# Altium schematic sheet logic.SchDoc: ADC & Delay
size A4; Author: Niklas Fauth; DrawnBy: Niklas Fauth; Address4: Niklas Fauth; Revision: V1.0; SheetNumber: 2; SheetTotal: 5; ProjectName: Jammer; Rule: PcbType=ProtelPcb; Rule: PcbType=ProtelPcb
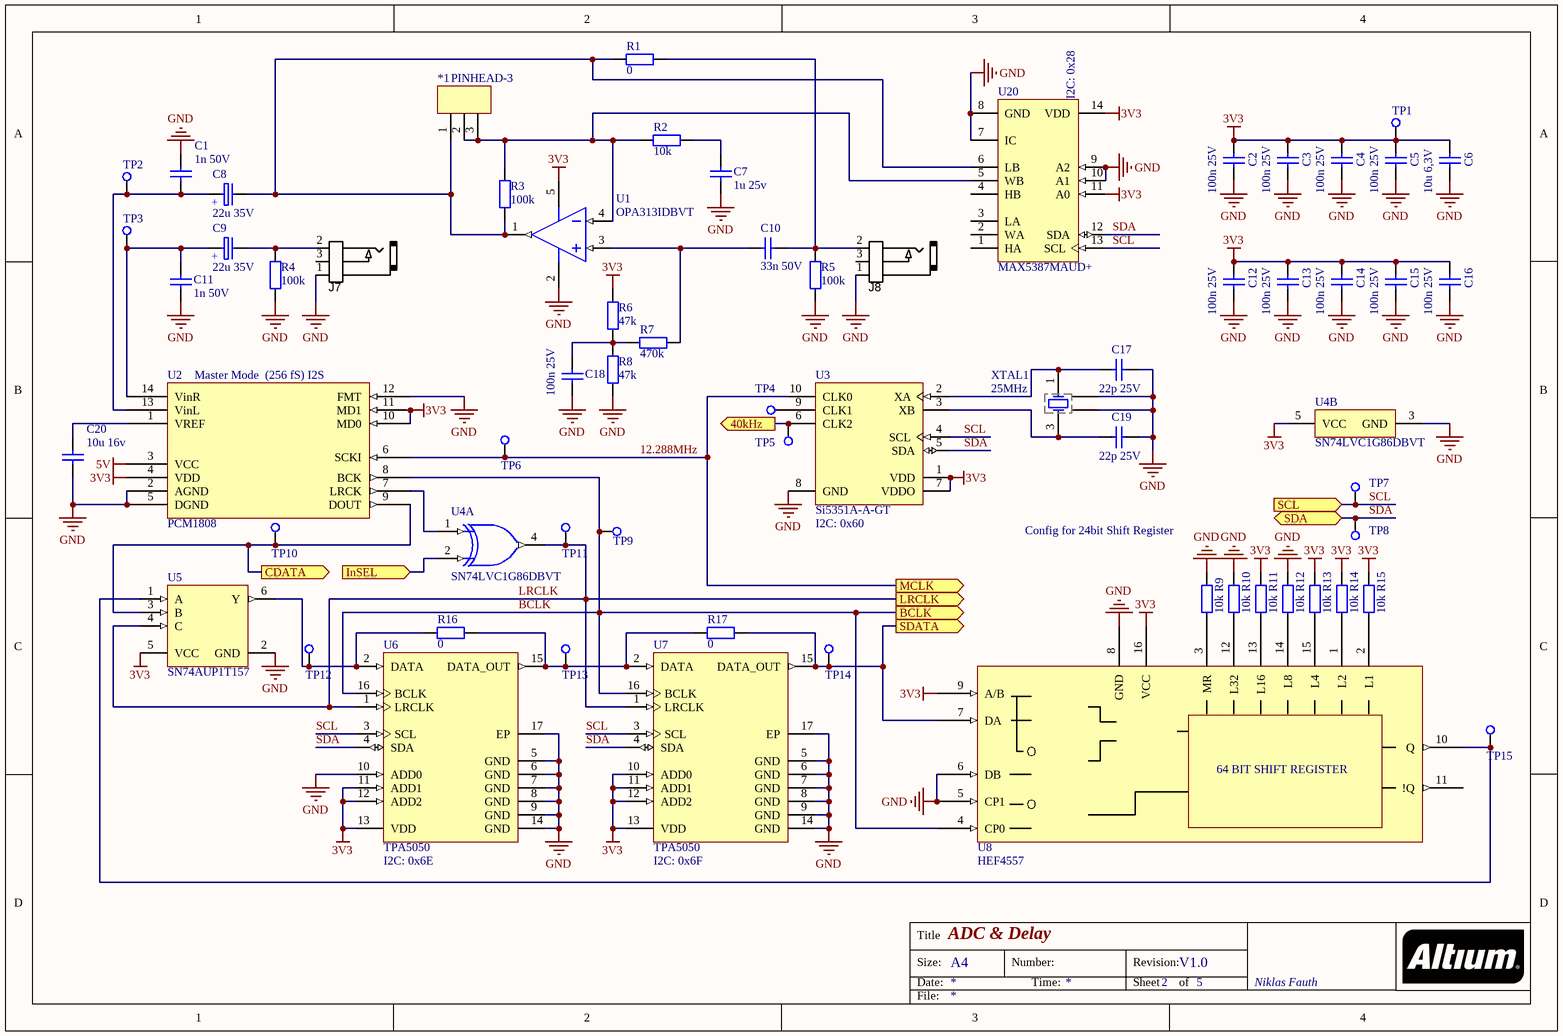
[diagram p0: logic.SchDoc]

## Parts
*1  PINHEAD-3  [PINHEAD-3]
C1  1n 50V  [C-0603-H]
C2  100n 25V  [C-0603-H]
C3  100n 25V  [C-0603-H]
C4  100n 25V  [C-0603-H]
C5  100n 25V  [C-0603-H]
C6  10u 6,3V  [C-0603-H]
C7  1u 25v  [C-0603-H]
C8  22u 35V  [SMD-6.3-3.9]
C9  22u 35V  [SMD-6.3-3.9]
C10  33n 50V  [C-0603-M]
C11  1n 50V  [C-0603-H]
C12  100n 25V  [C-0603-H]
C13  100n 25V  [C-0603-H]
C14  100n 25V  [C-0603-H]
C15  100n 25V  [C-0603-H]
C16  100n 25V  [C-0603-H]
C17  22p 25V  [C-0402-M]
C18  100n 25V  [C-0603-H]
C19  22p 25V  [C-0402-M]
C20  10u 16v  [C-0603-H]
J7  Mono phone jack  [CONN_AudioJackMono]  (value not drawn)
J8  Mono phone jack  [CONN_AudioJackMono]  (value not drawn)
R1  0  [R-0603-M]
R2  10k  [R-0603-H]
R3  100k  [R-0603-M]
R4  100k  [R-0603-M]
R5  100k  [R-0603-M]
R6  47k  [R-0603-H]
R7  470k  [R-0603-H]
R8  47k  [R-0603-H]
R9  10k  [R-0603-H]
R10  10k  [R-0603-H]
R11  10k  [R-0603-H]
R12  10k  [R-0603-H]
R13  10k  [R-0603-H]
R14  10k  [R-0603-H]
R15  10k  [R-0603-H]
R16  0  [R-0603-M]
R17  0  [R-0603-M]
TP1  TP-SMD  [TP]  (value not drawn)
TP2  TP-SMD  [TP]  (value not drawn)
TP3  TP-SMD  [TP]  (value not drawn)
TP4  TP-SMD  [TP]  (value not drawn)
TP5  TP-SMD  [TP]  (value not drawn)
TP6  TP-SMD  [TP]  (value not drawn)
TP7  TP-SMD  [TP]  (value not drawn)
TP8  TP-SMD  [TP]  (value not drawn)
TP9  TP-SMD  [TP]  (value not drawn)
TP10  TP-SMD  [TP]  (value not drawn)
TP11  TP-SMD  [TP]  (value not drawn)
TP12  TP-SMD  [TP]  (value not drawn)
TP13  TP-SMD  [TP]  (value not drawn)
TP14  TP-SMD  [TP]  (value not drawn)
TP15  TP-SMD  [TP]  (value not drawn)
U1  OPA313IDBVT  [DBV0005A_M]
U2  PCM1808  [TSOP65P640X120-14N]
U3  Si5351A-A-GT  [SLAB-MSOP-10_M]
U4  SN74LVC1G86DBVT  [DBV0005A_N]  (parts A,B of 2)
U5  SN74AUP1T157  [DCK0006A_M]
U6  TPA5050  [QFN16-4x4-0.65 big holes]
U7  TPA5050  [QFN16-4x4-0.65 big holes]
U8  HEF4557  [SOIC127P600X265-16N]
U20  MAX5387MAUD+  [MAXM-U14+1_N]
XTAL1  25MHz  [ABM11]

## Ports
40kHz (out), BCLK (out), CDATA (out), InSEL (in), LRCLK (out), MCLK (out), SCL (in), SDA (bidir), SDATA (out)

## Nets
3V3: C2.2 C3.2 C4.2 C5.2 C6.2 C12.2 C13.2 C14.2 C15.2 C16.2 R6.2 R11.2 R13.2 R14.2 R15.2 TP1.1 U1.5(V+) U2.4(VDD) U2.10(MD0) U2.11(MD1) U3.1(VDD) U3.7(VDDO) U4.5(VCC) U5.5(VCC) U6.11(ADD1) U6.12(ADD2) U6.13(VDD) U7.10(ADD0) U7.11(ADD1) U7.12(ADD2) U7.13(VDD) U8.9(A/B) U8.16(VCC) U20.11(A0) U20.14(VDD)
5V: U2.3(VCC)
GND: C1.2 C2.1 C3.1 C4.1 C5.1 C6.1 C7.1 C11.2 C12.1 C13.1 C14.1 C15.1 C16.1 C17.2 C18.1 C19.2 C20.1 J7.1(Base) J8.1(Base) R4.1 R5.1 R8.1 R9.2 R10.2 R12.2 U1.2(V-) U2.2(AGND) U2.5(DGND) U2.12(FMT) U3.8(GND) U4.3(GND) U5.2(GND) U6.5(GND) U6.6(GND) U6.7(GND) U6.8(GND) U6.9(GND) U6.10(ADD0) U6.14(GND) U6.17(EP) U7.5(GND) U7.6(GND) U7.7(GND) U7.8(GND) U7.9(GND) U7.14(GND) U7.17(EP) U8.5(CP1) U8.6(DB) U8.8(GND) U20.7(IC) U20.8(GND) U20.9(A2) U20.10(A1) XTAL1.2 XTAL1.4
12.288MHz: TP6.1 U2.6(SCKI) U3.10(CLK0) ; port MCLK
40kHz: TP5.1 U3.6(CLK2) ; port 40kHz
BCLK: TP9.1 U2.8(BCK) U6.16(BCLK) U7.16(BCLK) U8.4(CP0) ; port BCLK
CDATA: TP10.1 U2.9(DOUT) U5.3(B) ; port CDATA
InSEL: U4.2(B) ; port InSEL
LRCLK: TP11.1 U4.4(Y) U5.4(C) U6.1(LRCLK) U7.1(LRCLK) ; port LRCLK
SCL: TP7.1 U3.4(SCL) U6.3(SCL) U7.3(SCL) U20.13(SCL) ; port SCL
SDA: TP8.1 U3.5(SDA) U6.4(SDA) U7.4(SDA) U20.12(SDA) ; port SDA
SDATA: R17.2 TP14.1 U7.15(DATA_OUT) U8.7(DA) ; port SDATA
Net*1_1: *1.1 C8.1 R1.1 R3.1 U1.1(OUT) U20.6(LB)
Net*1_2: *1.2 *1.3 R2.1 R3.2 U1.4(IN-) U20.5(WB)
NetC1_1: C1.1 C8.2 TP2.1 U2.13(VinL)
NetC7_2: C7.2 R2.2
NetC9_1: C9.1 J7.2(TIP) R4.2
NetC9_2: C9.2 C11.1 TP3.1 U2.14(VinR)
NetC10_1: C10.1 R7.1 U1.3(IN+)
NetC10_2: C10.2 J8.2(TIP) R1.2 R5.2
NetC17_1: C17.1 U3.2(XA) XTAL1.1
NetC18_2: C18.2 R6.1 R7.2 R8.2
NetC19_1: C19.1 U3.3(XB) XTAL1.3
NetC20_2: C20.2 U2.1(VREF)
NetR9_1: R9.1 U8.3(MR)
NetR10_1: R10.1 U8.12(L32)
NetR11_1: R11.1 U8.13(L16)
NetR12_1: R12.1 U8.14(L8)
NetR13_1: R13.1 U8.15(L4)
NetR14_1: R14.1 U8.1(L2)
NetR15_1: R15.1 U8.2(L1)
NetR16_1: R16.1 TP12.1 U5.6(Y) U6.2(DATA)
NetR16_2: R16.2 R17.1 TP13.1 U6.15(DATA_OUT) U7.2(DATA)
NetTP4_1: TP4.1 U3.9(CLK1)
NetTP15_1: TP15.1 U5.1(A) U8.10(Q)
NetU2_7: U2.7(LRCK) U4.1(A)

Not connected (* = marked no-connect by the designer): J7 3(Middle); J8 3(Middle); U8 11(!Q); U20 1(HA) 2(WA) 3(LA) 4(HB)

## Notes on the sheet
- (near U20) I2C: 0x28
- (near U2) Master Mode  (256 fS) I2S
- (near U3) I2C: 0x60
- Config for 24bit Shift Register
- (near U6) I2C: 0x6E
- (near U7) I2C: 0x6F
- Title
- Size:
- Date:
- A4
- Number:
- Time:
- Revision:
- Sheet
- of
- File:
- (in symbol CE-SMD-22u-35V) +
- (in symbol HEF4557) 64 BIT SHIFT REGISTER

## Library data of the parts
C1 C11 = C-0603-1n-50V: Capacitor 1nF 50V; Supplier 1: Mouser; Supplier Part Number 1: 80-C0603C102J5G
C2-C5 C12-C16 C18 = C-0603-100n-25V: Capacitor 100n 25V; Supplier 1: Mouser; Supplier Part Number 1: 80-C0603C104K3R
C6 = C-0603-10u-6,3V: Capacitor 10uF 6,3V; Supplier 1: Mouser; Supplier Part Number 1: 80-C0603C106M9P
C7 = C-0603-1u-25V: Capacitor 1uF 25V; Supplier 1: Mouser; Supplier Part Number 1: 80-C0603C105K3R
C8 C9 = CE-SMD-22u-35V: electrolytic capacitor 22u 35V; Supplier 1: Mouser; Supplier Part Number 1: 647-UZR1V220MCL1GB
C10 = C-0603-33n-50V: Capacitor 33nF 50V; Supplier 1: Mouser; Supplier Part Number 1: 80-C0603C333K5R
C17 C19 = C-0402-22p-25V: Capacitor 22pF 25V; Supplier 1: Mouser; Supplier Part Number 1: 80-C0402C220J3G
C20 = C-0603-10u-16v: Capacitor 10uF 16v; Supplier 1: Mouser; Supplier Part Number 1: 963-AMK107BJ106MA-T
J7 J8 = CONN_AUDIOJACKMONO_3.5mm_RA_THD: 3.5mm Audio jack - Mono; Manufacturer 1: CUI Inc; Manufacturer Part Number 1: MJ-3502; Ratings: 1A; 12VDC; SCDType: undef; Material: Plastic, brass, silver; Package / Case: right-angle THD; Supplier 1: Digi-Key; Supplier Part Number 1: CP-3502MJ-ND
R1 R16 R17 = R-0603-0: Resistor 0; Supplier 1: Mouser; Supplier Part Number 1: 71-CRCW0603-0-E3; Resistance: 0
R2 R9-R15 = R-0603-10k: Resistor 10k; Supplier 1: Mouser; Supplier Part Number 1: 71-CRCW0603-10K-E3
R3-R5 = R-0603-100k: Resistor 100k; Supplier 1: Mouser; Supplier Part Number 1: 71-CRCW0603-100K-E3
R6 R8 = R-0603-47k: Resistor 4k7; Supplier 1: Mouser; Supplier Part Number 1: 71-CRCW060347K0FKEB
R7 = R-0603-470k: Resistor 470k; Supplier 1: Mouser; Supplier Part Number 1: 71-CRCW0603-470K-E3
U1 = CMP-0810-00003-2: 1-MHz, Micropower, Low-Noise, Rail-to-Rail I/O Operational Amplifier, 1.8 to 5.5 V, -40 to 125 degC, 5-pin SOT23 (DBV5), Green (RoHS & no Sb/Br); Manufacturer: Texas Instruments; Offset Drift(Typ)(uV/C): 2; SubFamily: Low Input Bias Current Amp (<=10pA), Low Power Amp (<=500uA); Iq per channel(Max)(mA): 0.06; Total Supply Voltage(Min)(+5V is 5, +/-5V is 10): 1.8; CMRR(Min)(dB): 70; Packing: SMALL T&R; Total Supply Voltage(Max)(+5V is 5, +/-5V is 10): 5.5; Slew Rate(Typ)(V/us): 0.5; GBW(Typ)(MHz): 1; Rating: Catalog; Vio (25C)(Max)(mV): 2.5; ComponentLink3URL: http://www.ti.com/litv/pdf/mpds018i; ComponentLink2Description: Datasheet; ComponentLink1Description: Manufacturer URL; ComponentLink2URL: http://www.ti.com/lit/ds/symlink/opa313.pdf; PartNumber: OPA313IDBVT; Eco-Plan: Green (RoHS & no Sb/Br); PackageDescription: 5-Pin Plastic Small Outline, Body 1.6 x 2.9 mm, Pitch 0.95 mm; PackageReference: DBV0005A; ComponentLink1URL: http://www.ti.com/; Mounting Technology: Surface Mount; DatasheetVersion: SBOS649C; PackageVersion: 4073253-4/K, 03/2006; Code_JEDEC: MO-178; Number of Channels: 1; ComponentLink3Description: Package Specification
U3 = CMP-0510-00011-1: I2C-Programmable Any-Frequency CMOS Clock Generator + VCXO, 2.5 / 3.3 V, 0.008 to 160 MHz Output, -40 to 85 degC, 10-pin SOP; Manufacturer: Silicon Labs; Sub-Family: Clock Generators; Reference Inputs: 1; Output Format: LVCMOS; VDD: 2.5 V; 3.3 V; PackageReference: MSOP-10; ComponentLink3URL: http://www.silabs.com/Support Documents/TechnicalDocs/C8051T60x.pdf; ComponentLink1URL: http://www.silabs.com/; Mounting Technology: Surface Mount; ComponentLink2Description: Datasheet; ComponentLink3Description: Package Specification; PartNumber: Si5351A-A-GT; ComponentLink1Description: Manufacturer URL; DatasheetVersion: Rev. 0.95; Code_IPC: J-STD-020; Output Frequency (MHz): 0.008 to 160; Code_JEDEC: MO-187; ComponentLink2URL: http://www.silabs.com/Support%20Documents/TechnicalDocs/Si5351.pdf; PackageDescription: 10-Pin Mini Small Outline Package, Body 3 x 3 mm, Pitch 0.5 mm
U4 = CMP-0859-00170-3: Single 2-Input Exclusive-OR Gate, DBV0005A, SMALL T&R; Manufacturer: Texas Instruments; Schmitt Trigger: No; Output Drive (IOL/IOH)(Max)(mA): 32/-32; Rating: Catalog; ICC @ Nom Voltage(Max)(mA): 0.01; Output Type: CMOS; Bits(#): 1; Technology Family: LVC; F @ Nom Voltage(Max)(Mhz): 150; VCC(Min)(V): 1.65; Input Type: CMOS/TTL; Voltage(Nom)(V): 1.8,2.5,3.3,5; Sub-Family: XOR Gate; Logic: True; tpd @ Nom Voltage(Max)(ns): 9.9,5.5,5,4; Gate Type: XOR; VCC(Max)(V): 5.5; Operating Temperature Range(C): -40 to 125,-40 to 85; 3-State Output: No; DatasheetVersion: SCES222O; Generic Part Number: SN74LVC1G86; PackageReference: DBV0005A; PartId: 1
U5 = CMP-0859-00521-3: Low Power, 1.8/2.5/3.3-V In, 3.3-V CMOS Out, Buffer Multiplexer (Noninverted), DCK0006A, LARGE T&R; Manufacturer: Texas Instruments; Logic: True; ICC @ Nom Voltage(Max)(mA): 0.0009; Bits(#): 1; VCC(Min)(V): 0.8; Schmitt Trigger: No; Sub-Family: Single Supply Translator; F @ Nom Voltage(Max)(Mhz): 190; tpd @ Nom Voltage(Max)(ns): 9.8,8.5,7.8; Voltage(Nom)(V): 1.8,2.5,3.3; Rating: Catalog; VCC(Max)(V): 3.6; Technology Family: AUP1T; Output Drive (IOL/IOH)(Max)(mA): 4/-4; Input Type: CMOS; 3-State Output: No; Operating Temperature Range(C): -40 to 85; DatasheetVersion: SCES807; Generic Part Number: SN74AUP1T157; Output Type: CMOS; PackageReference: DCK0006A
U20 = CMP-0022-00051-1: Dual, Low-Voltage Digital Potentiometer with I2C Control Interface, Volatile, Linear Taper, 256 Steps, -40 to 125 degC, 14-pin TSSOP (U14+1), Pb-Free; PartNumber: MAX5387MAUD+; ComponentLink1Description: Manufacturer URL; ComponentLink1URL: http://www.maximintegrated.com/; Code_JEDEC: MO-153; ComponentLink2Description: Datasheet; PackageReference: U14+1; Applications: Low-Voltage Battery Applications, Portable Consumer; Control Interface: I2C; ComponentLink3Description: Package Specification; Mounting Technology: Surface Mount; PackageDescription: 14-Pin Thin Shrink Small-Outline Package (U14+1), Body 5 x 4.4 mm, Pitch 0.65 mm; ComponentLink2URL: http://datasheets.maximintegrated.com/en/ds/MAX5387.pdf; PackageVersion: Rev. L, 07/2010; DatasheetVersion: Rev. 2; ComponentLink3URL: http://pdfserv.maximintegrated.com/package_dwgs/21-0066.PDF
XTAL1 = ABM11-25MHz: Supplier 1: Mouser; Supplier Part Number 1: 815-ABM11-25-D2XT3
U6 U7 = TPA5050: Supplier 1: Mouser; Supplier Part Number 1: 595-TPA5050RSAR